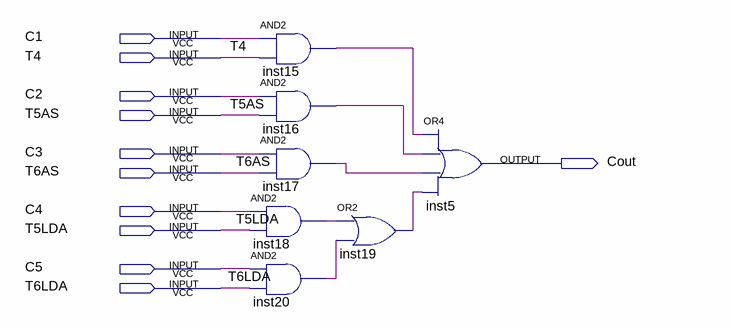
[diagram p0: schematic sheet]
// Quartus schematic MUX.bdf as structural Verilog: 7 symbols, 11 pins
module MUX (
  input  C1,
  input  T4,
  input  C2,
  input  T5AS,
  input  C3,
  input  T6AS,
  input  C4,
  input  T5LDA,
  input  C5,
  input  T6LDA,
  output Cout
);

  wire inst15_out, inst16_out, inst17_out, inst18_out, inst19_out, inst20_out;

  and inst15 (inst15_out, C1, T4);
  and inst16 (inst16_out, C2, T5AS);
  and inst17 (inst17_out, C3, T6AS);
  and inst18 (inst18_out, C4, T5LDA);
  and inst20 (inst20_out, C5, T6LDA);
  or inst19 (inst19_out, inst18_out, inst20_out);
  or inst5 (Cout, inst15_out, inst16_out, inst17_out, inst19_out);
endmodule
